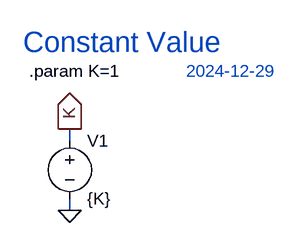
[diagram p0: schematic CONST.asc]
CONST.asc, the LTspice schematic file:
Version 4
SHEET 1 880 680
WIRE 144 96 144 80
WIRE 144 192 144 176
FLAG 144 192 0
FLAG 144 80 K
IOPIN 144 80 Out
SYMBOL voltage 144 80 R0
WINDOW 123 0 0 Left 0
WINDOW 39 0 0 Left 0
SYMATTR InstName V1
SYMATTR Value {K}
TEXT 88 0 Left 2 !.param K=1
TEXT 80 -40 Left 4 ;Constant Value
TEXT 304 0 Left 2 ;2024-12-29

The netlist it stands for:
* CONST.asc
V1 K 0 {K}
.param K=1
* Constant Value
* 2024-12-29
.backanno
.end